# Altium schematic sheet Electrical Power System.SchDoc
size A3; SheetNumber: 1; SheetTotal: 7
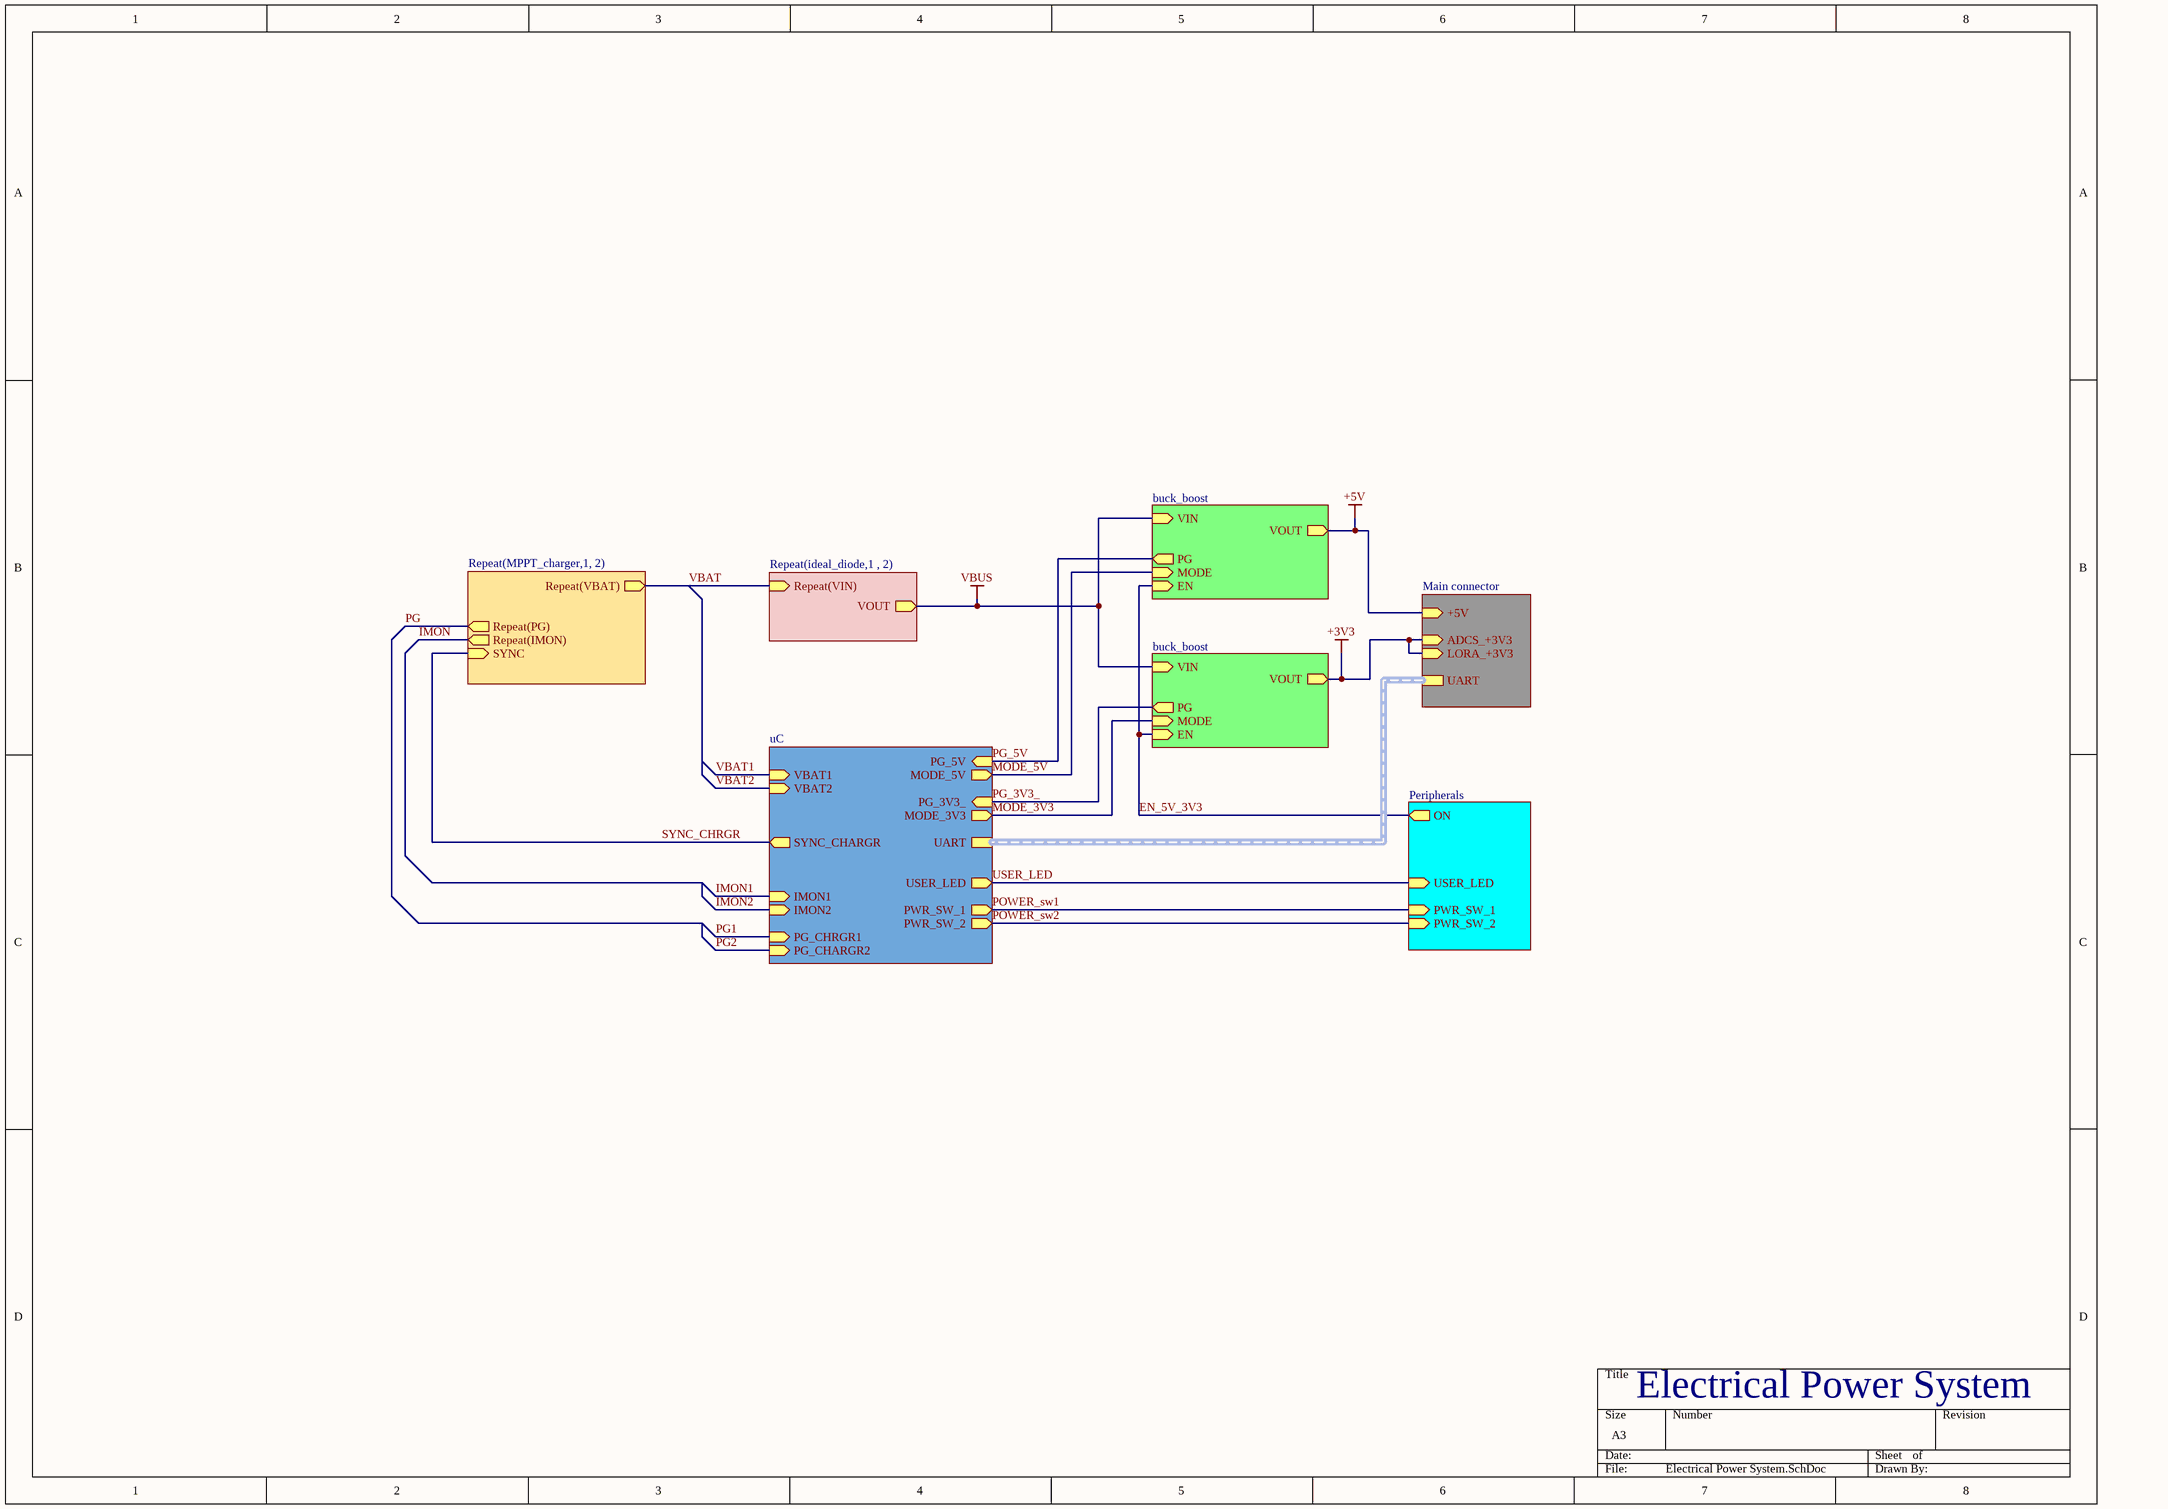
[diagram p0: Electrical Power System.SchDoc]

## Sub-sheets
Repeat(ideal diode, 1, 2) = Repeat(ideal_diode,1 , 2): VOUT (out), Repeat(VIN) (in)
Repeat(MPPT_charger, 1, 2) = Repeat(MPPT_charger,1, 2): SYNC (in), Repeat(IMON) (out), Repeat(PG) (out), Repeat(VBAT) (out)
U_Board-to-board Connector = Main connector: ADCS_+3V3 (in), LORA_+3V3 (in), +5V (in), UART (harness *)
U_Buck - Boost Converter = buck_boost: VIN (in), MODE (in), EN (in), PG (out), VOUT (out)
U_Buck - Boost Converter = buck_boost: VIN (in), MODE (in), EN (in), PG (out), VOUT (out)
U_LEDs Connector = Peripherals: USER_LED (in), PWR_SW_1 (in), PWR_SW_2 (in), ON (out)
U_Microcontroller = uC: IMON1 (in), IMON2 (in), SYNC_CHARGR (out), PG_3V3_ (in), MODE_3V3 (out), PG_5V (in), MODE_5V (out), PG_CHRGR1 (in), PG_CHARGR2 (in), USER_LED (out), PWR_SW_2 (out), PWR_SW_1 (out), UART (harness *), VBAT1 (in), VBAT2 (in)

## Nets
+3V3: sheet U_Board-to-board Connector/ADCS_+3V3, sheet U_Board-to-board Connector/LORA_+3V3, sheet U_Buck - Boost Converter/VOUT
+5V: sheet U_Buck - Boost Converter/VOUT, sheet U_Board-to-board Connector/+5V
VBUS: sheet Repeat(ideal diode, 1, 2)/VOUT, sheet U_Buck - Boost Converter/VIN, sheet U_Buck - Boost Converter/VIN
EN_5V_3V3: sheet U_Buck - Boost Converter/EN, sheet U_LEDs Connector/ON, sheet U_Buck - Boost Converter/EN
IMON: sheet Repeat(MPPT_charger, 1, 2)/Repeat(IMON)
IMON1: sheet U_Microcontroller/IMON1
IMON2: sheet U_Microcontroller/IMON2
MODE_3V3: sheet U_Microcontroller/MODE_3V3, sheet U_Buck - Boost Converter/MODE
MODE_5V: sheet U_Microcontroller/MODE_5V, sheet U_Buck - Boost Converter/MODE
PG: sheet Repeat(MPPT_charger, 1, 2)/Repeat(PG)
PG1: sheet U_Microcontroller/PG_CHRGR1
PG2: sheet U_Microcontroller/PG_CHARGR2
PG_3V3_: sheet U_Microcontroller/PG_3V3_, sheet U_Buck - Boost Converter/PG
PG_5V: sheet U_Microcontroller/PG_5V, sheet U_Buck - Boost Converter/PG
POWER_sw1: sheet U_Microcontroller/PWR_SW_1, sheet U_LEDs Connector/PWR_SW_1
POWER_sw2: sheet U_Microcontroller/PWR_SW_2, sheet U_LEDs Connector/PWR_SW_2
SYNC_CHRGR: sheet U_Microcontroller/SYNC_CHARGR, sheet Repeat(MPPT_charger, 1, 2)/SYNC
USER_LED: sheet U_Microcontroller/USER_LED, sheet U_LEDs Connector/USER_LED
VBAT: sheet Repeat(MPPT_charger, 1, 2)/Repeat(VBAT), sheet Repeat(ideal diode, 1, 2)/Repeat(VIN)
VBAT1: sheet U_Microcontroller/VBAT1
VBAT2: sheet U_Microcontroller/VBAT2

## Buses and harness runs
harness sheet U_Board-to-board Connector/UART = sheet U_Microcontroller/UART

## Notes on the sheet
- Electrical Power System